# Altium schematic sheet DAC_SUPPLY.SchDoc: FMC DAC 1.5GS 4CH
size 420 x 297 mm; Author: G.Kasprowicz; CompanyName: WUT ISE; DrawnBy: G.Kasprowicz; Organization: WUT ISE; Address1: PW ISE; Address2: Nowowiejska 15/19 00-665 Warsaw; Address3: gkasprow@gmail.com; DocumentNumber: 7; Revision: 1; SheetNumber: 7; SheetTotal: 18; ModifiedBy: -; CheckedDate: -; Title2: DAC Supply & decoupling; DivGrp: WUT ISE; Designer: G.Kasprowicz; ModifiedDate: -; ProjectName: Sensor Box
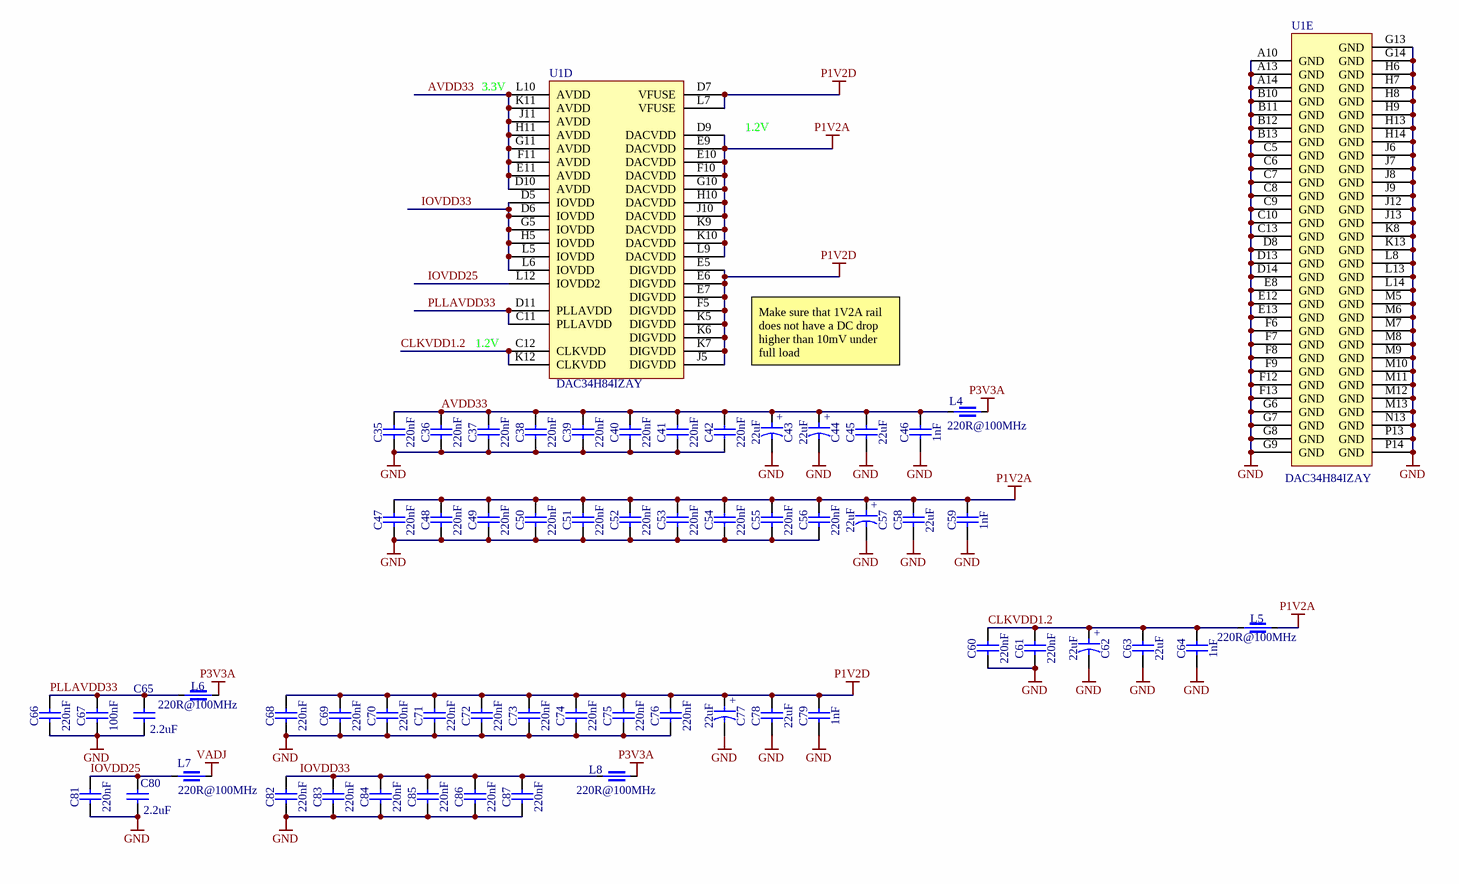
[diagram p0: DAC_SUPPLY.SchDoc]

## Parts
C35  220nF  [CAPC0603X33N]
C36  220nF  [CAPC0603X33N]
C37  220nF  [CAPC0603X33N]
C38  220nF  [CAPC0603X33N]
C39  220nF  [CAPC0603X33N]
C40  220nF  [CAPC0603X33N]
C41  220nF  [CAPC0603X33N]
C42  220nF  [CAPC0603X33N]
C43  22uF  [CAPMP3528X210N]
C44  22uF  [CAPMP3528X210N]
C45  22uF  [CAPC1709X100N]
C46  1nF  [CAPC1005X55N]
C47  220nF  [CAPC0603X33N]
C48  220nF  [CAPC0603X33N]
C49  220nF  [CAPC0603X33N]
C50  220nF  [CAPC0603X33N]
C51  220nF  [CAPC0603X33N]
C52  220nF  [CAPC0603X33N]
C53  220nF  [CAPC0603X33N]
C54  220nF  [CAPC0603X33N]
C55  220nF  [CAPC0603X33N]
C56  220nF  [CAPC0603X33N]
C57  22uF  [CAPMP3528X210N]
C58  22uF  [CAPC1709X100N]
C59  1nF  [CAPC1005X55N]
C60  220nF  [CAPC0603X33N]
C61  220nF  [CAPC0603X33N]
C62  22uF  [CAPMP3528X210N]
C63  22uF  [CAPC1709X100N]
C64  1nF  [CAPC1005X55N]
C65  2.2uF  [CAPC1005X55N]
C66  220nF  [CAPC0603X33N]
C67  100nF  [CAPC1005X55N]
C68  220nF  [CAPC0603X33N]
C69  220nF  [CAPC0603X33N]
C70  220nF  [CAPC0603X33N]
C71  220nF  [CAPC0603X33N]
C72  220nF  [CAPC0603X33N]
C73  220nF  [CAPC0603X33N]
C74  220nF  [CAPC0603X33N]
C75  220nF  [CAPC0603X33N]
C76  220nF  [CAPC0603X33N]
C77  22uF  [CAPMP3528X210N]
C78  22uF  [CAPC1709X100N]
C79  1nF  [CAPC1005X55N]
C80  2.2uF  [CAPC1005X55N]
C81  220nF  [CAPC0603X33N]
C82  220nF  [CAPC0603X33N]
C83  220nF  [CAPC0603X33N]
C84  220nF  [CAPC0603X33N]
C85  220nF  [CAPC0603X33N]
C86  220nF  [CAPC0603X33N]
C87  220nF  [CAPC0603X33N]
L4  220R@100MHz  [INDC1608X95N]
L5  220R@100MHz  [INDC1608X95N]
L6  220R@100MHz  [INDC1608X95N]
L7  220R@100MHz  [INDC1608X95N]
L8  220R@100MHz  [INDC1608X95N]
U1  DAC34H84IZAY  [TI-ZAY196]  (parts D,E of 5)

## Nets
GND: C35.1 C36.1 C37.1 C38.1 C39.1 C40.1 C41.1 C42.1 C43.2 C44.2 C45.1 C46.1 C47.1 C48.1 C49.1 C50.1 C51.1 C52.1 C53.1 C54.1 C55.1 C56.1 C57.2 C58.1 C59.1 C60.1 C61.1 C62.2 C63.1 C64.1 C65.1 C66.1 C67.1 C68.1 C69.1 C70.1 C71.1 C72.1 C73.1 C74.1 C75.1 C76.1 C77.2 C78.1 C79.1 C80.1 C81.1 C82.1 C83.1 C84.1 C85.1 C86.1 C87.1 U1.A10(GND) U1.A13(GND) U1.A14(GND) U1.B10(GND) U1.B11(GND) U1.B12(GND) U1.B13(GND) U1.C5(GND) U1.C6(GND) U1.C7(GND) U1.C8(GND) U1.C9(GND) U1.C10(GND) U1.C13(GND) U1.D8(GND) U1.D13(GND) U1.D14(GND) U1.E8(GND) U1.E12(GND) U1.E13(GND) U1.F6(GND) U1.F7(GND) U1.F8(GND) U1.F9(GND) U1.F12(GND) U1.F13(GND) U1.G6(GND) U1.G7(GND) U1.G8(GND) U1.G9(GND) U1.G13(GND) U1.G14(GND) U1.H6(GND) U1.H7(GND) U1.H8(GND) U1.H9(GND) U1.H13(GND) U1.H14(GND) U1.J6(GND) U1.J7(GND) U1.J8(GND) U1.J9(GND) U1.J12(GND) U1.J13(GND) U1.K8(GND) U1.K13(GND) U1.L8(GND) U1.L13(GND) U1.L14(GND) U1.M5(GND) U1.M6(GND) U1.M7(GND) U1.M8(GND) U1.M9(GND) U1.M10(GND) U1.M11(GND) U1.M12(GND) U1.M13(GND) U1.N13(GND) U1.P13(GND) U1.P14(GND)
P1V2A: C47.2 C48.2 C49.2 C50.2 C51.2 C52.2 C53.2 C54.2 C55.2 C56.2 C57.1 C58.2 C59.2 L5.2 U1.D9(DACVDD) U1.E9(DACVDD) U1.E10(DACVDD) U1.F10(DACVDD) U1.G10(DACVDD) U1.H10(DACVDD) U1.J10(DACVDD) U1.K9(DACVDD) U1.K10(DACVDD) U1.L9(DACVDD)
P1V2D: C68.2 C69.2 C70.2 C71.2 C72.2 C73.2 C74.2 C75.2 C76.2 C77.1 C78.2 C79.2 U1.D7(VFUSE) U1.E5(DIGVDD) U1.E6(DIGVDD) U1.E7(DIGVDD) U1.F5(DIGVDD) U1.J5(DIGVDD) U1.K5(DIGVDD) U1.K6(DIGVDD) U1.K7(DIGVDD) U1.L7(VFUSE)
P3V3A: L4.2 L6.2 L8.2
VADJ: L7.2
AVDD33: C35.2 C36.2 C37.2 C38.2 C39.2 C40.2 C41.2 C42.2 C43.1 C44.1 C45.2 C46.2 L4.1 U1.D10(AVDD) U1.E11(AVDD) U1.F11(AVDD) U1.G11(AVDD) U1.H11(AVDD) U1.J11(AVDD) U1.K11(AVDD) U1.L10(AVDD)
CLKVDD1.2: C60.2 C61.2 C62.1 C63.2 C64.2 L5.1 U1.C12(CLKVDD) U1.K12(CLKVDD)
IOVDD25: C80.2 C81.2 L7.1 U1.L12(IOVDD2)
IOVDD33: C82.2 C83.2 C84.2 C85.2 C86.2 C87.2 L8.1 U1.D5(IOVDD) U1.D6(IOVDD) U1.G5(IOVDD) U1.H5(IOVDD) U1.L5(IOVDD) U1.L6(IOVDD)
PLLAVDD33: C65.2 C66.2 C67.2 L6.1 U1.C11(PLLAVDD) U1.D11(PLLAVDD)

## Notes on the sheet
- (near U1) 3.3V
- 1.2V
- Make sure that 1V2A rail does not have a DC drop higher than 10mV under full load
- Project/Equipment
- Document
- Designer
- Drawn by
- Check.by
- Copyright WUT ISE 2018.
  This documentation describes Open Hardware and is licensed under the CERN OHL v.1.1. You may redistribute and modify this documentation under the terms of the CERN OHL v.1.1. (http://ohwr.org/CERNOHL). This documentation is distributed WITHOUT ANY EXPRESS OR IMPLIED WARRANTY, INCLUDING OF MERCHANTABILITY, SATISFACTORY QUALITY AND FITNESS FOR A PARTICULAR PURPOSE. Please see the CERN OHL v.1.1 for applicable conditions.
- Contact
- File
- Last Mod.
- Print Date
- Sheet
- Size
- A3
- of
- Rev
- (in symbol CTE3528-21_22UF_10V_10%_LESR0700) +

## Library data of the parts
C35-C42 C47-C56 C60 C61 C66 C68-C76 C81-C87 = CC0201_220NF_6.3V_20%_X5R: Non-polarised capacitor; Part Description: SMD Multilayer Chip Ceramic Capacitor; Manufacturer: GENERIC; Manufacturer1 Part Number: JMK063BJ224MP-F; Voltage: 6.3V; TC: X5R; Tolerance: ±20%; Part Number: CC0201_220NF_6.3V_20%_X5R; Component Kind: Standard; Component Type: Standard; Pin Count: 2; Value: 220nF; Status: Not Recommended; Manufacturer Part Number: CC0201_220NF_6.3V_20%_X5R; Case: 0201; Mounted: Yes; Socket: No; SMD: Yes; Sense: No; Manufacturer1 Example: TAIYO YUDEN; Manufacturer1 ComponentHeight: 0.33mm; HelpURL: \\cern.ch\dfs\Applications\Altium\Datasheets\CC0201_X5R_TAIYO-YUDEN_STANDARD-CLASS2.pdf; Author: CERN DEM JLC; CreateDate: 27.05.2010; LatestRevisionDate: 27.05.2010
C43 C44 C57 C62 C77 = CTE3528-21_22UF_10V_10%_LESR0700: Polarised capacitor; Part Description: Low ESR 0R7 Solid Tantalum Chip Capacitor; Manufacturer: GENERIC; Manufacturer1 Part Number: TPSB226K010R0700; Voltage: 10V; Tolerance: ±10%; Part Number: CTE3528-21_22UF_10V_10%_LESR0700; Component Kind: Standard; Component Type: Standard; Pin Count: 2; Value: 22uF; Status: Preferred; Manufacturer Part Number: CTE3528-21_22UF_10V_10%_LESR0700; Case: B; Mounted: Yes; Socket: No; SMD: Yes; Sense: No; Manufacturer1 Example: AVX; Manufacturer1 ComponentHeight: 2.1mm; HelpURL: \\cern.ch\dfs\Applications\Altium\Datasheets\CTE-LESR_AVX_TPS.pdf; Author: CERN DEM JLC; CreateDate: 05.05.2008; LatestRevisionDate: 20.01.2009
C45 C58 C63 C78 = CC0603_22UF_6.3V_20%_X5R: Non-polarised capacitor; Part Description: SMD Multilayer Chip Ceramic Capacitor; Manufacturer: GENERIC; Manufacturer1 Part Number: C1608X5R0J226M080AC; Voltage: 6.3V; TC: X5R; Tolerance: ±20%; Part Number: CC0603_22UF_6.3V_20%_X5R; Component Kind: Standard; Component Type: Standard; Pin Count: 2; Value: 22uF; Status: None; Manufacturer Part Number: CC0603_22UF_6.3V_20%_X5R; Case: 0603; Mounted: Yes; Socket: No; SMD: Yes; Sense: No; Manufacturer1 Example: TDK; Manufacturer1 ComponentHeight: 1mm; HelpURL: \\cern.ch\dfs\Applications\Altium\Datasheets\CC0603_X5R_TDK_C.pdf; Author: CERN DEM JLC; CreateDate: 16.12.2013; LatestRevisionDate: 13.09.2016
C46 C59 C64 C79 = CC0402_1NF_50V_10%_X7R: Non-polarised capacitor; Part Description: SMD Multilayer Chip Ceramic Capacitor; Manufacturer: GENERIC; Manufacturer1 Part Number: 223858715623; Voltage: 50V; TC: X7R; Tolerance: ±10%; Part Number: CC0402_1NF_50V_10%_X7R; Component Kind: Standard; Component Type: Standard; Pin Count: 2; Value: 1nF; Status: Not Recommended; Manufacturer Part Number: CC0402_1NF_50V_10%_X7R; Case: 0402; Mounted: Yes; Socket: No; SMD: Yes; Sense: No; Manufacturer1 Example: PHYCOMP; Manufacturer1 ComponentHeight: 0.55mm; HelpURL: \\cern.ch\dfs\Applications\Altium\Datasheets\CC0402_X7R_PHYCOMP.pdf; Author: CERN DEM JLC; CreateDate: 03.12.2007; LatestRevisionDate: 03.12.2007
C65 C80 = CC0402_2.2UF_6.3V_10%_X5R: Non-polarised capacitor; Part Description: SMD Multilayer Chip Ceramic Capacitor; Manufacturer: GENERIC; Manufacturer1 Part Number: C1005X5R0J225K050BC; Voltage: 6.3V; TC: X5R; Tolerance: ±10%; Part Number: CC0402_2.2UF_6.3V_10%_X5R; Component Kind: Standard; Component Type: Standard; Pin Count: 2; Value: 2.2uF; Status: Preferred; Manufacturer Part Number: CC0402_2.2UF_6.3V_10%_X5R; Case: 0402; Mounted: Yes; Socket: No; SMD: Yes; Sense: No; Manufacturer1 Example: TDK; Manufacturer1 ComponentHeight: 0.55mm; HelpURL: \\cern.ch\dfs\Applications\Altium\Datasheets\CC0402_X5R_TDK_C.pdf; Author: CERN DEM JMW; CreateDate: 22.09.2015; LatestRevisionDate: 22.09.2015
C67 = CC0402_100NF_16V_10%_X5R: Non-polarised capacitor; Part Description: SMD Multilayer Chip Ceramic Capacitor; Manufacturer: GENERIC; Manufacturer1 Part Number: GRM155R61C104KA88D; Voltage: 16V; TC: X5R; Tolerance: ±10%; Part Number: CC0402_100NF_16V_10%_X5R; Component Kind: Standard; Component Type: Standard; Pin Count: 2; Value: 100nF; Status: None; Manufacturer Part Number: CC0402_100NF_16V_10%_X5R; Case: 0402; Mounted: Yes; Socket: No; SMD: Yes; Sense: No; Manufacturer1 Example: MURATA; Manufacturer1 ComponentHeight: 0.55mm; HelpURL: \\cern.ch\dfs\Applications\Altium\Datasheets\CC0402_X5R_MURATA_GRM.pdf; Author: CERN DEM JLC; CreateDate: 10.12.2013; LatestRevisionDate: 10.12.2013
L4-L8 = IND0603_MURATA_BLM18SG221TN1: Part Description: SMD EMIFIL Suppression Chip Ferrite Bead; Manufacturer: MURATA; Power: 2.5A; Resistance: 0.04R; Tolerance: ±25%; Part Number: IND0603_MURATA_BLM18SG221TN1; Component Kind: Standard; Component Type: Standard; Pin Count: 2; Value: 220R@100MHz; Status: None; Manufacturer Part Number: BLM18SG221TN1; Case: 0603; Mounted: Yes; Socket: No; SMD: Yes; Sense: No; ComponentHeight: 0.95mm; HelpURL: \\cern.ch\dfs\Applications\Altium\Datasheets\IND0603_MURATA_BLM18S.pdf; Author: CERN DEM MR; CreateDate: 08.01.2016; LatestRevisionDate: 25.10.2018
U1 = CMP-0004-01532-1: Quad-Channel, 16-Bit, 1.5 GSPS DAC, -40 to 85 degC, 196-pin BGA (ZAY196), Green (RoHS & no Sb/Br); Manufacturer: Texas Instruments; Interface: Parallel LVDS; Resolution(Bits): 16; SubFamily: High Speed DAC (>10MSPS); Power Consumption(Typ)(mW): 1828; SFDR(dB): 78; DAC Channels: 4; Mounting Technology: Surface Mount; ComponentLink3URL: http://www.ti.com/litv/pdf/mpbga11; PartNumber: DAC34H84IZAY; ComponentLink1Description: Manufacturer URL; Eco-Plan: Green (RoHS & no Sb/Br); PackageDescription: 196-Pin Plastic Ball Grid Array, Body 12 x 12 mm, Pitch 0.8 mm; PackageVersion: 4208324-4/C, 09/2010; PackageReference: ZAY196; ComponentLink1URL: http://www.ti.com/; ComponentLink2URL: http://www.ti.com/general/docs/lit/getliterature.tsp?genericPartNumber=DAC34SH84&fileType=pdf; DatasheetVersion: SLAS808D; ComponentLink3Description: Package Specification; ComponentLink2Description: Datasheet